# Altium schematic sheet MercurialSDR_FTDI.SchDoc: MercurialSDR - FTDI Interface
size A4; Author: Andres Hojnadel; DrawnBy: Andres Hojnadel; Revision: Rev1.0; SheetNumber: 3; SheetTotal: 6; ProjectName: MercurialSDR
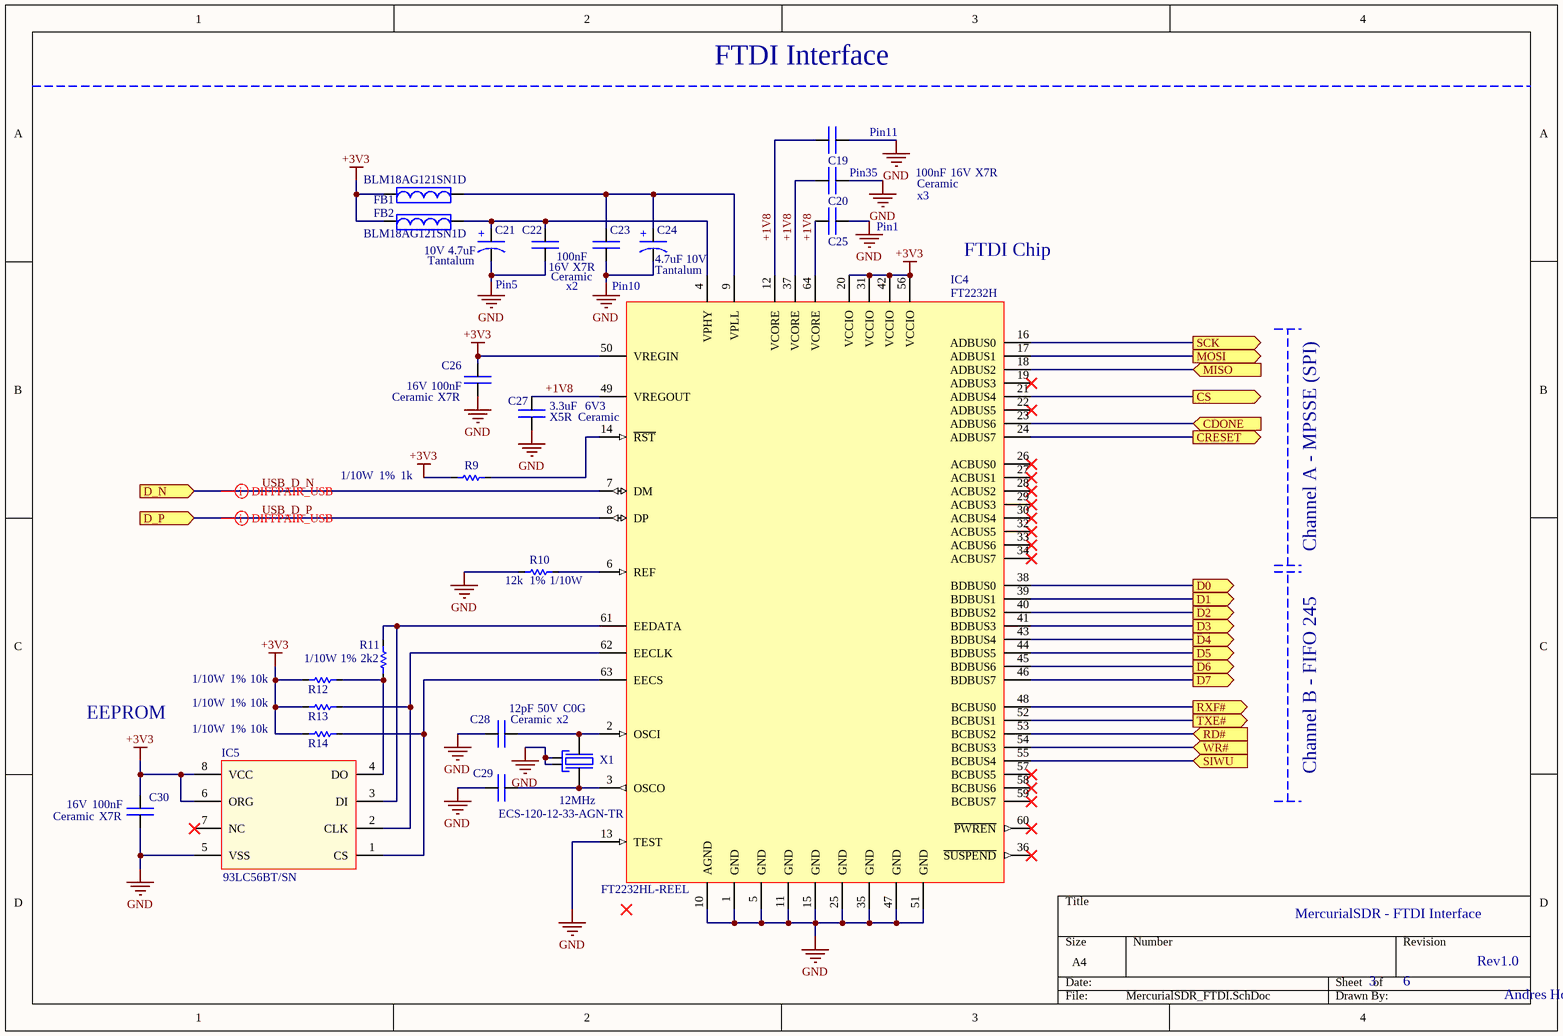
[diagram p0: MercurialSDR_FTDI.SchDoc]

## Parts
C19  value 100nF  Temp Coef: X7R  VR: 16V  Material: Ceramic  [CAP_0603]  (hidden comment: Capacitor)
C20  Capacitor  [CAP_0603]  (value not drawn)
C21  value 4.7uF  VR: 10V  Material: Tantalum  [CAP_TANT_1206]  (hidden comment: Capacitor Polarizado)
C22  value 100nF  Temp Coef: X7R  VR: 16V  Material: Ceramic  [CAP_0603]  (hidden comment: Capacitor)
C23  Capacitor  [CAP_0603]  (value not drawn)
C24  value 4.7uF  VR: 10V  Material: Tantalum  [CAP_TANT_1206]  (hidden comment: Capacitor Polarizado)
C25  Capacitor  [CAP_0603]  (value not drawn)
C26  value 100nF  Temp Coef: X7R  VR: 16V  Material: Ceramic  [CAP_0603]  (hidden comment: Capacitor)
C27  value 3.3uF  Temp Coef: X5R  VR: 6V3  Material: Ceramic  [CAP_0603]  (hidden comment: Capacitor)
C28  value 12pF  Temp Coef: C0G  VR: 50V  Material: Ceramic  [CAP_0603]  (hidden comment: Capacitor)
C29  Capacitor  [CAP_0603]  (value not drawn)
C30  value 100nF  Temp Coef: X7R  VR: 16V  Material: Ceramic  [CAP_0603]  (hidden comment: Capacitor)
FB1  Part Number: BLM18AG121SN1D  [FERRITE_BEAD_0603]  (hidden comment: Ferrite Bead)
FB2  Part Number: BLM18AG121SN1D  [FERRITE_BEAD_0603]  (hidden comment: Ferrite Bead)
IC4  FT2232H  Part Number: FT2232HL-REEL  [LQFP_64]
IC5  93LC56BT  [SOIC-8]  (value not drawn)
R9  value 1k  Power: 1/10W  Tolerance: 1%  [RES_0603]  (hidden comment: Resistor SMD)
R10  value 12k  Power: 1/10W  Tolerance: 1%  [RES_0603]  (hidden comment: Resistor SMD)
R11  value 2k2  Power: 1/10W  Tolerance: 1%  [RES_0603]  (hidden comment: Resistor SMD)
R12  value 10k  Power: 1/10W  Tolerance: 1%  [RES_0603]  (hidden comment: Resistor SMD)
R13  value 10k  Power: 1/10W  Tolerance: 1%  [RES_0603]  (hidden comment: Resistor SMD)
R14  value 10k  Power: 1/10W  Tolerance: 1%  [RES_0603]  (hidden comment: Resistor SMD)
X1  Part Number: ECS-120-12-33-AGN-TR  Frquency: 12MHz  [XTAL_3.2x2.5]  (hidden comment: XTAL_4term)

## Ports
CDONE (in), CRESET (out), CS (out), D0 (out), D1 (out), D2 (out), D3 (out), D4 (out), D5 (out), D6 (out), D7 (out), D_N (in), D_P (in), MISO (in), MOSI (out), RD# (in), RXF# (out), SCK (out), SIWU (in), TXE# (out), WR# (in)

## Nets
+3V3: C26.1 C30.1 FB1.1 FB2.1 IC4.20(VCCIO) IC4.31(VCCIO) IC4.42(VCCIO) IC4.50(VREGIN) IC4.56(VCCIO) IC5.6(ORG) IC5.8(VCC) R9.2 R12.2 R13.1 R14.1
GND: C19.2 C20.2 C21.2 C22.2 C23.2 C24.2 C25.2 C26.2 C27.2 C28.2 C29.1 C30.2 IC4.1(GND) IC4.5(GND) IC4.10(AGND) IC4.11(GND) IC4.13(TEST) IC4.15(GND) IC4.25(GND) IC4.35(GND) IC4.47(GND) IC4.51(GND) IC5.5(VSS) R10.2 X1.2 X1.4
+1V8: C19.1 C20.1 C25.1 C27.1 IC4.12(VCORE) IC4.37(VCORE) IC4.49(VREGOUT) IC4.64(VCORE)
CDONE: IC4.23(ADBUS6) ; port CDONE
CRESET: IC4.24(ADBUS7) ; port CRESET
CS: IC4.21(ADBUS4) ; port CS
D0: IC4.38(BDBUS0) ; port D0
D1: IC4.39(BDBUS1) ; port D1
D2: IC4.40(BDBUS2) ; port D2
D3: IC4.41(BDBUS3) ; port D3
D4: IC4.43(BDBUS4) ; port D4
D5: IC4.44(BDBUS5) ; port D5
D6: IC4.45(BDBUS6) ; port D6
D7: IC4.46(BDBUS7) ; port D7
MISO: IC4.18(ADBUS2) ; port MISO
MOSI: IC4.17(ADBUS1) ; port MOSI
RD#: IC4.53(BCBUS2) ; port RD#
RXF#: IC4.48(BCBUS0) ; port RXF#
SCK: IC4.16(ADBUS0) ; port SCK
SIWU: IC4.55(BCBUS4) ; port SIWU
TXE#: IC4.52(BCBUS1) ; port TXE#
USB_D_N: IC4.7(DM) ; port D_N
USB_D_P: IC4.8(DP) ; port D_P
WR#: IC4.54(BCBUS3) ; port WR#
NetC21_1: C21.1 C22.1 FB2.2 IC4.4(VPHY)
NetC23_1: C23.1 C24.1 FB1.2 IC4.9(VPLL)
NetC28_1: C28.1 IC4.2(OSCI) X1.1
NetC29_2: C29.2 IC4.3(OSCO) X1.3
NetIC4_6: IC4.6(REF) R10.1
NetIC4_14: IC4.14(~{RST}) R9.1
NetIC4_61: IC4.61(EEDATA) IC5.3(DI) R11.2
NetIC4_62: IC4.62(EECLK) IC5.2(CLK) R13.2
NetIC4_63: IC4.63(EECS) IC5.1(CS) R14.2
NetIC5_4: IC5.4(DO) R11.1 R12.1

Not connected (* = marked no-connect by the designer): IC4 19(ADBUS3)* 22(ADBUS5)* 26(ACBUS0)* 27(ACBUS1)* 28(ACBUS2)* 29(ACBUS3)* 30(ACBUS4)* 32(ACBUS5)* 33(ACBUS6)* 34(ACBUS7)* 36(~{SUSPEND})* 57(BCBUS5)* 58(BCBUS6)* 59(BCBUS7)* 60(~{PWREN})*; IC5 7(NC)*

## Layout directives
differential pair: USB_D_N, USB_D_P

## Notes on the sheet
- FTDI Interface
- (near C20) Pin35
- Pin11
- Pin1
- x3
- Pin5
- x2
- (near IC4) Pin10
- (near IC4) FTDI Chip
- Channel A - MPSSE (SPI)
- EEPROM
- (near X1) x2
- Channel B - FIFO 245
- (in symbol Cap Pol) +

## Library data of the parts
C19 C22 C26 C30 = Cap: Capacitor no polarizado; Part Number: CL10B104KO8NNNC
C20 C23 C25 = Cap: Capacitor no polarizado; Part Number: CL10B104KO8NNNC; Value: 100nF; Temp Coef: X7R; VR: 16V; Material: Ceramic
C21 C24 = Cap Pol: Part Number: TAJA475K010RNJ; Temp Coef: *
C27 = Cap: Capacitor no polarizado; Part Number: C0603C335M9PACTU
C28 = Cap: Capacitor no polarizado; Part Number: CL10C120JB8NNNC
C29 = Cap: Capacitor no polarizado; Part Number: CL10C120JB8NNNC; Value: 12pF; Temp Coef: C0G; VR: 50V; Material: Ceramic
IC4 = FT2232H: USB bridge
IC5 = 93LC56BT/SN: EEPROM SPI 2kb (128x16); Part Number: 93LC56BT/SN
R9 = Res: Resistor; Part Number: CR0603-FX-1001ELF
R10 = Res: Resistor; Part Number: CR0603-FX-1202ELF
R11 = Res: Resistor; Part Number: CR0603-FX-2201ELF
R12-R14 = Res: Resistor; Part Number: CR0603-FX-1002EAS
X1 = XTAL_4term: Oscilador a Cristal